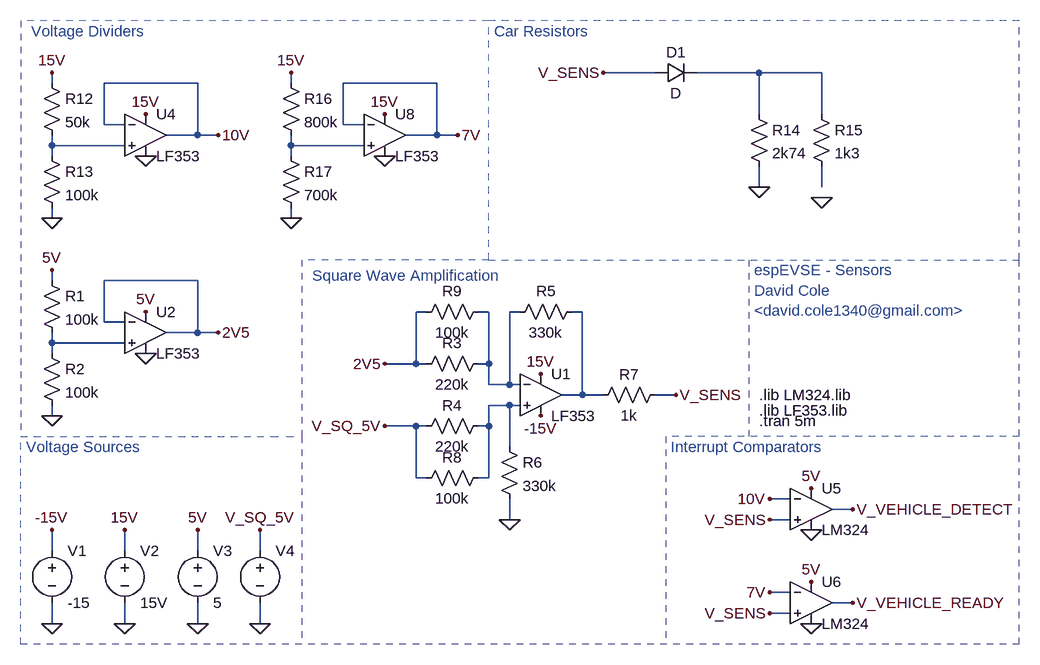
[diagram p0: schematic Sensing.asc]
Sensing.asc, the LTspice schematic file:
Version 4
SHEET 1 1912 680
WIRE 896 -560 816 -560
WIRE 1056 -560 960 -560
WIRE 1152 -560 1056 -560
WIRE -32 -544 -32 -560
WIRE 192 -544 48 -544
WIRE 336 -544 336 -560
WIRE 560 -544 416 -544
WIRE 1056 -496 1056 -560
WIRE 1152 -496 1152 -560
WIRE 48 -480 48 -544
WIRE 80 -480 48 -480
WIRE 416 -480 416 -544
WIRE 448 -480 416 -480
WIRE 192 -464 192 -544
WIRE 192 -464 144 -464
WIRE 224 -464 192 -464
WIRE 560 -464 560 -544
WIRE 560 -464 512 -464
WIRE 592 -464 560 -464
WIRE -32 -448 -32 -464
WIRE 80 -448 -32 -448
WIRE 336 -448 336 -464
WIRE 448 -448 336 -448
WIRE -32 -432 -32 -448
WIRE 336 -432 336 -448
WIRE 1056 -384 1056 -416
WIRE 1152 -384 1152 -416
WIRE -32 -336 -32 -352
WIRE 336 -336 336 -352
WIRE -32 -240 -32 -256
WIRE 192 -240 48 -240
WIRE 544 -192 528 -192
WIRE 640 -192 624 -192
WIRE 688 -192 672 -192
WIRE 784 -192 768 -192
WIRE 48 -176 48 -240
WIRE 80 -176 48 -176
WIRE 192 -160 192 -240
WIRE 192 -160 144 -160
WIRE 224 -160 192 -160
WIRE -32 -144 -32 -160
WIRE 80 -144 -32 -144
WIRE -32 -128 -32 -144
WIRE 528 -112 528 -192
WIRE 528 -112 480 -112
WIRE 544 -112 528 -112
WIRE 640 -112 640 -192
WIRE 640 -112 624 -112
WIRE 640 -80 640 -112
WIRE 672 -80 672 -192
WIRE 672 -80 640 -80
WIRE 688 -80 672 -80
WIRE 784 -64 784 -192
WIRE 784 -64 752 -64
WIRE 816 -64 784 -64
WIRE 928 -64 896 -64
WIRE 672 -48 640 -48
WIRE 688 -48 672 -48
WIRE -32 -32 -32 -48
WIRE 528 -16 480 -16
WIRE 544 -16 528 -16
WIRE 640 -16 640 -48
WIRE 640 -16 624 -16
WIRE 672 16 672 -48
WIRE 528 64 528 -16
WIRE 544 64 528 64
WIRE 640 64 640 -16
WIRE 640 64 624 64
WIRE 1104 96 1072 96
WIRE 1200 112 1168 112
WIRE 672 128 672 96
WIRE 1104 128 1072 128
WIRE -32 176 -32 144
WIRE 80 176 80 144
WIRE 192 176 192 144
WIRE 288 176 288 144
WIRE 1104 240 1072 240
WIRE 1200 256 1168 256
WIRE 1104 272 1072 272
WIRE -32 288 -32 256
WIRE 80 288 80 256
WIRE 192 288 192 256
WIRE 288 288 288 256
FLAG -32 144 -15V
FLAG 80 144 15V
FLAG 192 144 5V
FLAG 288 144 V_SQ_5V
FLAG -32 288 0
FLAG 80 288 0
FLAG 192 288 0
FLAG 288 288 0
FLAG 112 -128 0
FLAG 112 -192 5V
FLAG -32 -32 0
FLAG -32 -256 5V
FLAG 224 -160 2V5
FLAG 720 -32 -15V
FLAG 720 -96 15V
FLAG 480 -16 V_SQ_5V
FLAG 480 -112 2V5
FLAG 672 128 0
FLAG 928 -64 V_SENS
FLAG 112 -432 0
FLAG 112 -496 15V
FLAG -32 -336 0
FLAG -32 -560 15V
FLAG 224 -464 10V
FLAG 1072 96 10V
FLAG 1072 128 V_SENS
FLAG 1072 272 V_SENS
FLAG 1136 80 5V
FLAG 1136 224 5V
FLAG 1136 144 0
FLAG 1136 288 0
FLAG 1200 112 V_VEHICLE_DETECT
FLAG 1072 240 7V
FLAG 1200 256 V_VEHICLE_READY
FLAG 1056 -384 0
FLAG 1152 -368 0
FLAG 816 -560 V_SENS
FLAG 480 -432 0
FLAG 480 -496 15V
FLAG 336 -336 0
FLAG 336 -560 15V
FLAG 592 -464 7V
SYMBOL voltage -32 160 R0
WINDOW 123 0 0 Left 0
WINDOW 39 0 0 Left 0
SYMATTR InstName V1
SYMATTR Value -15
SYMBOL voltage 80 160 R0
WINDOW 123 0 0 Left 0
WINDOW 39 0 0 Left 0
SYMATTR InstName V2
SYMATTR Value 15V
SYMBOL voltage 192 160 R0
WINDOW 123 0 0 Left 0
WINDOW 39 0 0 Left 0
SYMATTR InstName V3
SYMATTR Value 5
SYMBOL voltage 288 160 R0
WINDOW 3 24 96 Invisible 2
WINDOW 123 0 0 Left 0
WINDOW 39 0 0 Left 0
SYMATTR Value PULSE(0 5 1u 1u 1u 0.5m 1m)
SYMATTR InstName V4
SYMBOL res -48 -256 R0
SYMATTR InstName R1
SYMATTR Value 100k
SYMBOL res -48 -144 R0
SYMATTR InstName R2
SYMATTR Value 100k
SYMBOL Opamps\\opamp2 112 -224 R0
SYMATTR InstName U2
SYMATTR Value LF353
SYMBOL Opamps\\opamp2 720 -128 R0
SYMATTR InstName U1
SYMATTR Value LF353
SYMBOL res 640 -128 R90
WINDOW 0 0 56 VBottom 2
WINDOW 3 32 56 VTop 2
SYMATTR InstName R3
SYMATTR Value 220k
SYMBOL res 640 -32 R90
WINDOW 0 0 56 VBottom 2
WINDOW 3 32 56 VTop 2
SYMATTR InstName R4
SYMATTR Value 220k
SYMBOL res 784 -208 R90
WINDOW 0 0 56 VBottom 2
WINDOW 3 32 56 VTop 2
SYMATTR InstName R5
SYMATTR Value 330k
SYMBOL res 656 0 R0
SYMATTR InstName R6
SYMATTR Value 330k
SYMBOL res 912 -80 R90
WINDOW 0 0 56 VBottom 2
WINDOW 3 32 56 VTop 2
SYMATTR InstName R7
SYMATTR Value 1k
SYMBOL res 640 48 R90
WINDOW 0 0 56 VBottom 2
WINDOW 3 32 56 VTop 2
SYMATTR InstName R8
SYMATTR Value 100k
SYMBOL res 640 -208 R90
WINDOW 0 0 56 VBottom 2
WINDOW 3 32 56 VTop 2
SYMATTR InstName R9
SYMATTR Value 100k
SYMBOL res -48 -560 R0
SYMATTR InstName R12
SYMATTR Value 50k
SYMBOL res -48 -448 R0
SYMATTR InstName R13
SYMATTR Value 100k
SYMBOL Opamps\\opamp2 112 -528 R0
SYMATTR InstName U4
SYMATTR Value LF353
SYMBOL Opamps\\opamp2 1136 48 R0
SYMATTR InstName U5
SYMATTR Value LM324
SYMBOL Opamps\\opamp2 1136 192 R0
SYMATTR InstName U6
SYMATTR Value LM324
SYMBOL res 1040 -512 R0
SYMATTR InstName R14
SYMATTR Value 2k74
SYMBOL res 1136 -512 R0
SYMATTR InstName R15
SYMATTR Value 1k3
SYMBOL res 320 -560 R0
SYMATTR InstName R16
SYMATTR Value 800k
SYMBOL res 320 -448 R0
SYMATTR InstName R17
SYMATTR Value 700k
SYMBOL Opamps\\opamp2 480 -528 R0
SYMATTR InstName U8
SYMATTR Value LF353
SYMBOL diode 896 -544 R270
WINDOW 0 32 32 VTop 2
WINDOW 3 0 32 VBottom 2
SYMATTR InstName D1
TEXT 1056 -40 Left 2 !.lib LF353.lib
TEXT 1056 -24 Left 2 !.tran 5m
TEXT -64 -624 Left 2 ;Voltage Dividers
TEXT 648 -624 Left 2 ;Car Resistors
TEXT -72 16 Left 2 ;Voltage Sources
TEXT 368 -248 Left 2 ;Square Wave Amplification
TEXT 920 16 Left 2 ;Interrupt Comparators
TEXT 1048 -256 Left 2 ;espEVSE - Sensors\nDavid Cole\n<david.cole1340@gmail.com>
TEXT 1056 -64 Left 2 !.lib LM324.lib
LINE Normal 640 -272 640 -640 2
LINE Normal -80 0 304 0 2
LINE Normal -80 -640 -80 0 2
LINE Normal 640 -640 -80 -640 2
LINE Normal 1456 -640 640 -640 2
LINE Normal 640 -272 1456 -272 2
LINE Normal 1456 -272 1456 -640 2
LINE Normal -80 320 -80 0 2
LINE Normal 352 320 -80 320 2
LINE Normal 352 0 352 320 2
LINE Normal 352 -272 352 0 2
LINE Normal 304 0 352 0 2
LINE Normal 640 -272 352 -272 2
LINE Normal 912 0 912 320 2
LINE Normal 1456 320 1456 -272 2
LINE Normal 1456 320 352 320 2
LINE Normal 1456 0 912 0 2
LINE Normal 1040 -272 1040 0 2

The netlist it stands for:
* Sensing.asc
V1 -15V 0 -15
V2 15V 0 15V
V3 5V 0 5
V4 V_SQ_5V 0 PULSE(0 5 1u 1u 1u 0.5m 1m)
R1 5V N007 100k
R2 N007 0 100k
XU2 N007 2V5 5V 0 2V5 LF353  ; pins In+ In- V+ V- OUT
XU1 N008 N005 15V -15V N006 LF353  ; pins In+ In- V+ V- OUT
R3 N005 2V5 220k
R4 N008 V_SQ_5V 220k
R5 N006 N005 330k
R6 N008 0 330k
R7 V_SENS N006 1k
R8 N008 V_SQ_5V 100k
R9 N005 2V5 100k
R12 15V N002 50k
R13 N002 0 100k
XU4 N002 10V 15V 0 10V LF353  ; pins In+ In- V+ V- OUT
XU5 V_SENS 10V 5V 0 V_VEHICLE_DETECT LM324  ; pins In+ In- V+ V- OUT
XU6 V_SENS 7V 5V 0 V_VEHICLE_READY LM324  ; pins In+ In- V+ V- OUT
R14 N001 0 2k74
R15 N001 N004 1k3
R16 15V N003 800k
R17 N003 0 700k
XU8 N003 7V 15V 0 7V LF353  ; pins In+ In- V+ V- OUT
D1 V_SENS N001 D
.model D D
.lib standard.dio
.lib LF353.lib
.tran 5m
* Voltage Dividers
* Car Resistors
* Voltage Sources
* Square Wave Amplification
* Interrupt Comparators
* espEVSE - Sensors
* David Cole
* <david.cole1340@gmail.com>
.lib LM324.lib
.backanno
.end